# Altium schematic sheet STM+WirelessModule.SchDoc
size A4; SheetNumber: 1; SheetTotal: 6; SPICEModelCachePTLBQKII: <root> / <DocumentId>PTLBQKII</DocumentId> / </root>
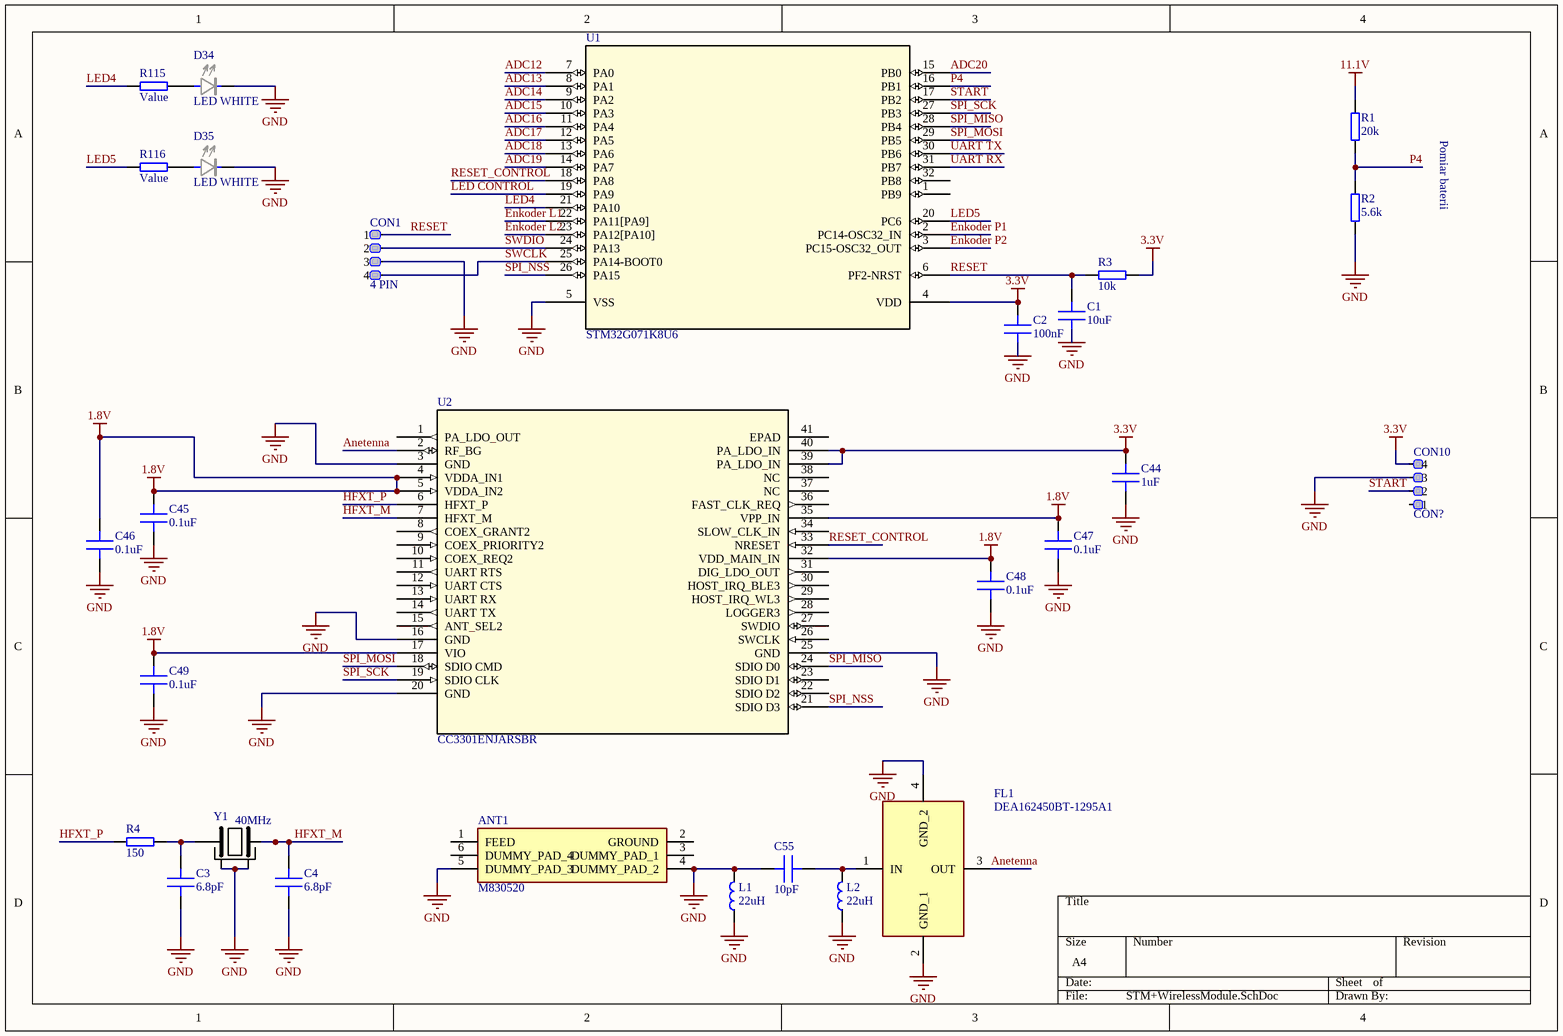
[diagram p0: STM+WirelessModule.SchDoc]

## Parts
ANT1  M830520  [M830520]
C1  10uF  [C 0603]
C2  100nF  [C 0603]
C3  6.8pF  [C 0603]
C4  6.8pF  [C 0603]
C44  1uF  [C 0603]
C45  0.1uF  [C 0603]
C46  0.1uF  [C 0603]
C47  0.1uF  [C 0603]
C48  0.1uF  [C 0603]
C49  0.1uF  [C 0603]
C55  10pF  [C 0603]
CON1  4 PIN  [BM04B-SRSS-TB]
CON10  CON?  [Goldpin 1.27mm 4PIN]
D34  LED WHITE  [LED 0603 White]
D35  LED WHITE  [LED 0603 White]
FL1  DEA162450BT-1295A1  [DEA162450BT1295A1]
L1  22uH  [L 1206]
L2  22uH  [L 1206]
R1  20k  [R 0603]
R2  5.6k  [R 0603]
R3  10k  [R 0603]
R4  150  [R 0603]
R115  Value  [R 0603]
R116  Value  [R 0603]
U1  STM32G071K8U6  [UFQFPN-32]
U2  CC3301ENJARSBR  [WQFN_JARSBR_TEX-M]
Y1  40MHz  [MCSJK7U1600123080B30]

## Nets
1.8V: C45.2 C46.2 C47.2 C48.2 C49.2 U2.4(VDDA_IN1) U2.5(VDDA_IN2) U2.17(VIO) U2.32(VDD_MAIN_IN) U2.35(VPP_IN)
3.3V: C2.2 C44.2 CON10.4 R3.1 U1.4(VDD) U2.39(PA_LDO_IN) U2.40(PA_LDO_IN)
11.1V: R1.2
GND: ANT1.4(DUMMY_PAD_2) ANT1.5(DUMMY_PAD_3) C1.1 C2.1 C3.1 C4.1 C44.1 C45.1 C46.1 C47.1 C48.1 C49.1 C55.2 CON1.3 CON10.3 D34.2 D35.2 FL1.2(GND_1) FL1.4(GND_2) L1.1 L1.2 L2.1 R2.1 U1.5(VSS) U2.3(GND) U2.16(GND) U2.20(GND) U2.25(GND) Y1.2(GND_1) Y1.4(GND_2)
ADC12: U1.7(PA0)
ADC13: U1.8(PA1)
ADC14: U1.9(PA2)
ADC15: U1.10(PA3)
ADC16: U1.11(PA4)
ADC17: U1.12(PA5)
ADC18: U1.13(PA6)
ADC19: U1.14(PA7)
ADC20: U1.15(PB0)
Anetenna: FL1.3(OUT) U2.2(RF_BG)
Enkoder L1: U1.22(PA11[PA9])
Enkoder L2: U1.23(PA12[PA10])
Enkoder P1: U1.2(PC14-OSC32_IN)
Enkoder P2: U1.3(PC15-OSC32_OUT)
HFXT_M: C4.2 U2.7(HFXT_M) Y1.3(CRYSTAL_2)
HFXT_P: R4.2 U2.6(HFXT_P)
LED4: R115.1 U1.21(PA10)
LED5: R116.1 U1.20(PC6)
LED CONTROL: U1.19(PA9)
P4: R1.1 R2.2 U1.16(PB1)
RESET: C1.2 CON1.1 R3.2 U1.6(PF2-NRST)
RESET_CONTROL: U1.18(PA8) U2.33(NRESET)
SPI_MISO: U1.28(PB4) U2.24(SDIO_D0)
SPI_MOSI: U1.29(PB5) U2.18(SDIO_CMD)
SPI_NSS: U1.26(PA15) U2.21(SDIO_D3)
SPI_SCK: U1.27(PB3) U2.19(SDIO_CLK)
START: CON10.2 U1.17(PB2)
SWCLK: CON1.4 U1.25(PA14-BOOT0)
SWDIO: CON1.2 U1.24(PA13)
UART RX: U1.31(PB7)
UART TX: U1.30(PB6)
NetC3_2: C3.2 R4.1 Y1.1(CRYSTAL_1)
NetC55_1: C55.1 FL1.1(IN) L2.2
NetD34_1: D34.1 R115.2
NetD35_1: D35.1 R116.2

Not connected (* = marked no-connect by the designer): ANT1 1(FEED) 2(GROUND) 3(DUMMY_PAD_1) 6(DUMMY_PAD_4); CON10 1; U1 1(PB9) 32(PB8); U2 1(PA_LDO_OUT) 8(COEX_GRANT2) 9(COEX_PRIORITY2) 10(COEX_REQ2) 11(UART_RTS) 12(UART_CTS) 13(UART_RX) 14(UART_TX) 15(ANT_SEL2) 22(SDIO_D2) 23(SDIO_D1) 26(SWCLK) 27(SWDIO) 28(LOGGER3) 29(HOST_IRQ_WL3) 30(HOST_IRQ_BLE3) 31(DIG_LDO_OUT) 34(SLOW_CLK_IN) 36(FAST_CLK_REQ) 37(NC) 38(NC) 41(EPAD)

## Notes on the sheet
- Pomiar baterii

## Library data of the parts
ANT1 = M830520: Antenna; Manufacturer_Name: AVX; Datasheet Link: http://datasheets.avx.com/ethertronics/AVX-E_M830520.pdf; Height: 1.4mm; Manufacturer_Part_Number: M830520; Mouser Part Number: 581-M830520; Mouser Price/Stock: https://www.mouser.co.uk/ProductDetail/AVX/M830520?qs=MLItCLRbWsxUgo9WosSjUA%3D%3D; Arrow Part Number: M830520; Arrow Price/Stock: https://www.arrow.com/en/products/m830520/avx?region=nac
C1 C2 C44-C49 C55 = Capacitor: MLCC Capacitor
C3 C4 = Capacitor: 50V 6.8pF
FL1 = DEA162450BT-1295A1: Filter; Manufacturer_Name: TDK; Datasheet Link: https://product.tdk.com/system/files/dam/doc/product/rf/rf/filter/catalog/rf_bpf_dea162450bt-1295a1_en.pdf; Height: 0.7mm; Manufacturer_Part_Number: DEA162450BT-1295A1; Mouser Part Number: 810-DEA162450BT1295A; Mouser Price/Stock: https://www.mouser.co.uk/ProductDetail/TDK/DEA162450BT-1295A1?qs=r5DSvlrkXmJWOg7G%2F4pSbg%3D%3D; Arrow Part Number: DEA162450BT-1295A1; Arrow Price/Stock: https://www.arrow.com/en/products/dea162450bt-1295a1/tdk?region=nac
L1 L2 = Inductor: General pourpouse inductor
R1-R4 R115 R116 = Resistor: General pourpouse resistor
U1 = STM32G071K8U6: No Description Available; Mfr_Name: STMicroelectronics; Copyright: Copyright (C) 2024 Ultra Librarian. All rights reserved.; Manufacturer_Part_Number: STM32G071K8U6; RefDes: RefDes; Type: DEV
U2 = CC3301ENJARSBR: No Description Available; Mfr_Name: Texas Instruments; Type: RF Transceiver ICs; RefDes: RefDes
Y1 = MCSJK-7U-16.00-12-30-80-B-30: Crystal or Oscillator; Manufacturer_Name: MULTICOMP; Datasheet Link: https://www.farnell.com/datasheets/2864166.pdf; Height: 0.8mm; Manufacturer_Part_Number: MCSJK-7U-16.00-12-30-80-B-30